# EAGLE design safeguard (EAGLE 8.4.0)
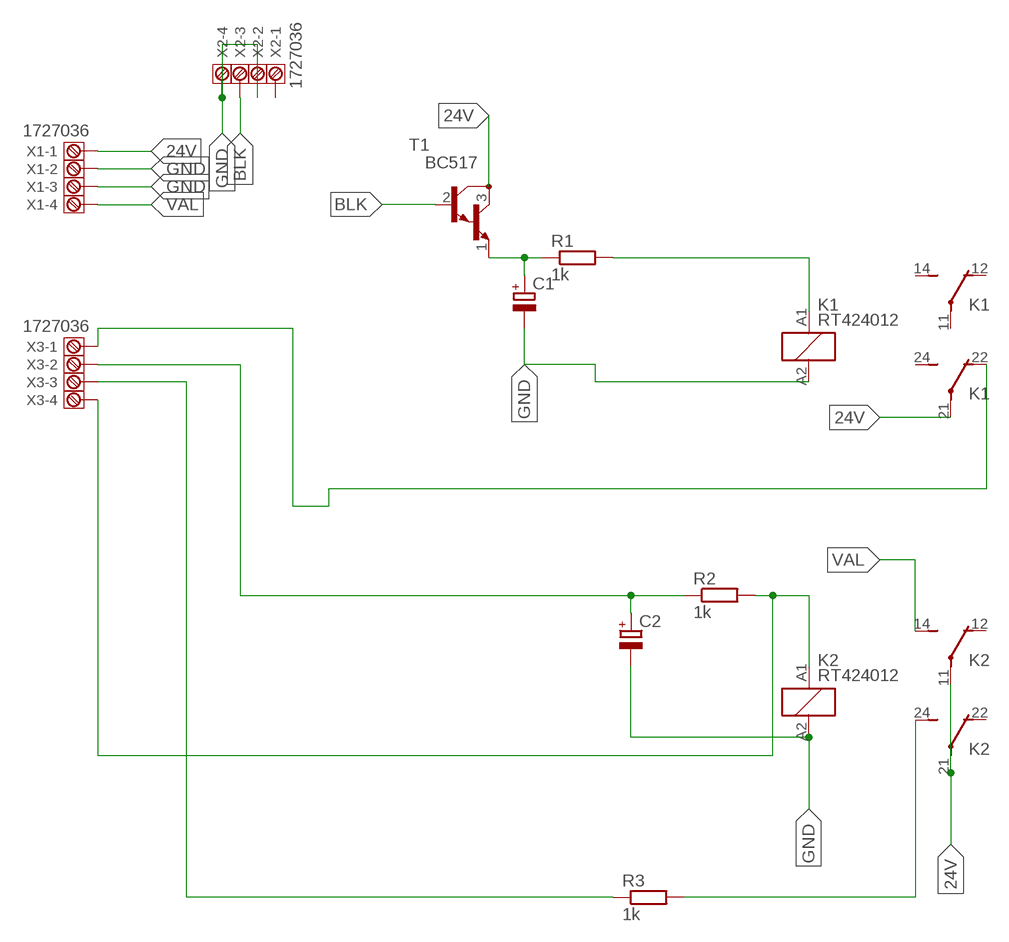
[diagram p0: schematic, sheet 1]

## Parts
C1  CPOL-EU153CLV-0405  [153CLV-0405]
C2  CPOL-EU153CLV-0405  [153CLV-0405]
K1  RT424012  [RT2C/O]
K2  RT424012  [RT2C/O]
R1  1k  R-EU_0204/7  [0204/7]
R2  1k  R-EU_0204/7  [0204/7]
R3  1k  R-EU_0204/7  [0204/7]
T1  BC517  [TO92]
X1  1727036  [1727036]
X2  1727036  [1727036]
X3  1727036  [1727036]

## Nets
24V: K1.21(3:P) K2.11(2:P) K2.21(3:P) T1.3(C) X1.1
BLK: T1.2(B) X2.3
GND: C1.- C2.- K1.A2 K2.A2 X1.2 X1.3 X2.2 X2.4
N$1: K1.22(3:O) X3.1
N$2: K2.A1 R2.2 X3.4
N$3: C1.+ R1.1 T1.1(E)
N$4: K1.A1 R1.2
N$6: C2.+ R2.1 X3.2
N$8: K2.24(3:S) R3.2
N$9: R3.1 X3.3
VAL: K2.14(2:S) X1.4
Unconnected: K1.11(2:P) K1.12(2:O) K1.14(2:S) K1.24(3:S) K2.12(2:O) K2.22(3:O) X2.1

## Library data of the parts
C1 C2 = resistor:CPOL-EU: POLARIZED CAPACITOR, European symbol
K1 K2 = relay:RT42?*: Power PCB Relay SCHRACK 2 pole 8 A, DC and AC-coil Source: http://www.schrack.com/.. 5842.pdf; MPN: RT424012; OC_FARNELL: 1629053; OC_NEWARK: 03P2426
R1-R3 = resistor:R-EU_: RESISTOR, European symbol
T1 = transistor-neu-to92:BC517: NPN BIPOLAR DARLINGTON TRANSISTOR
X1-X3 = con-phoenix-3.81:1727036: MKDS 1/4-3,81 Source: http://eshop.phoenixcontact.de; MF: FARNELL; MPN: 1727036; OC_FARNELL: 3704592; OC_NEWARK: 71C4114

## Board
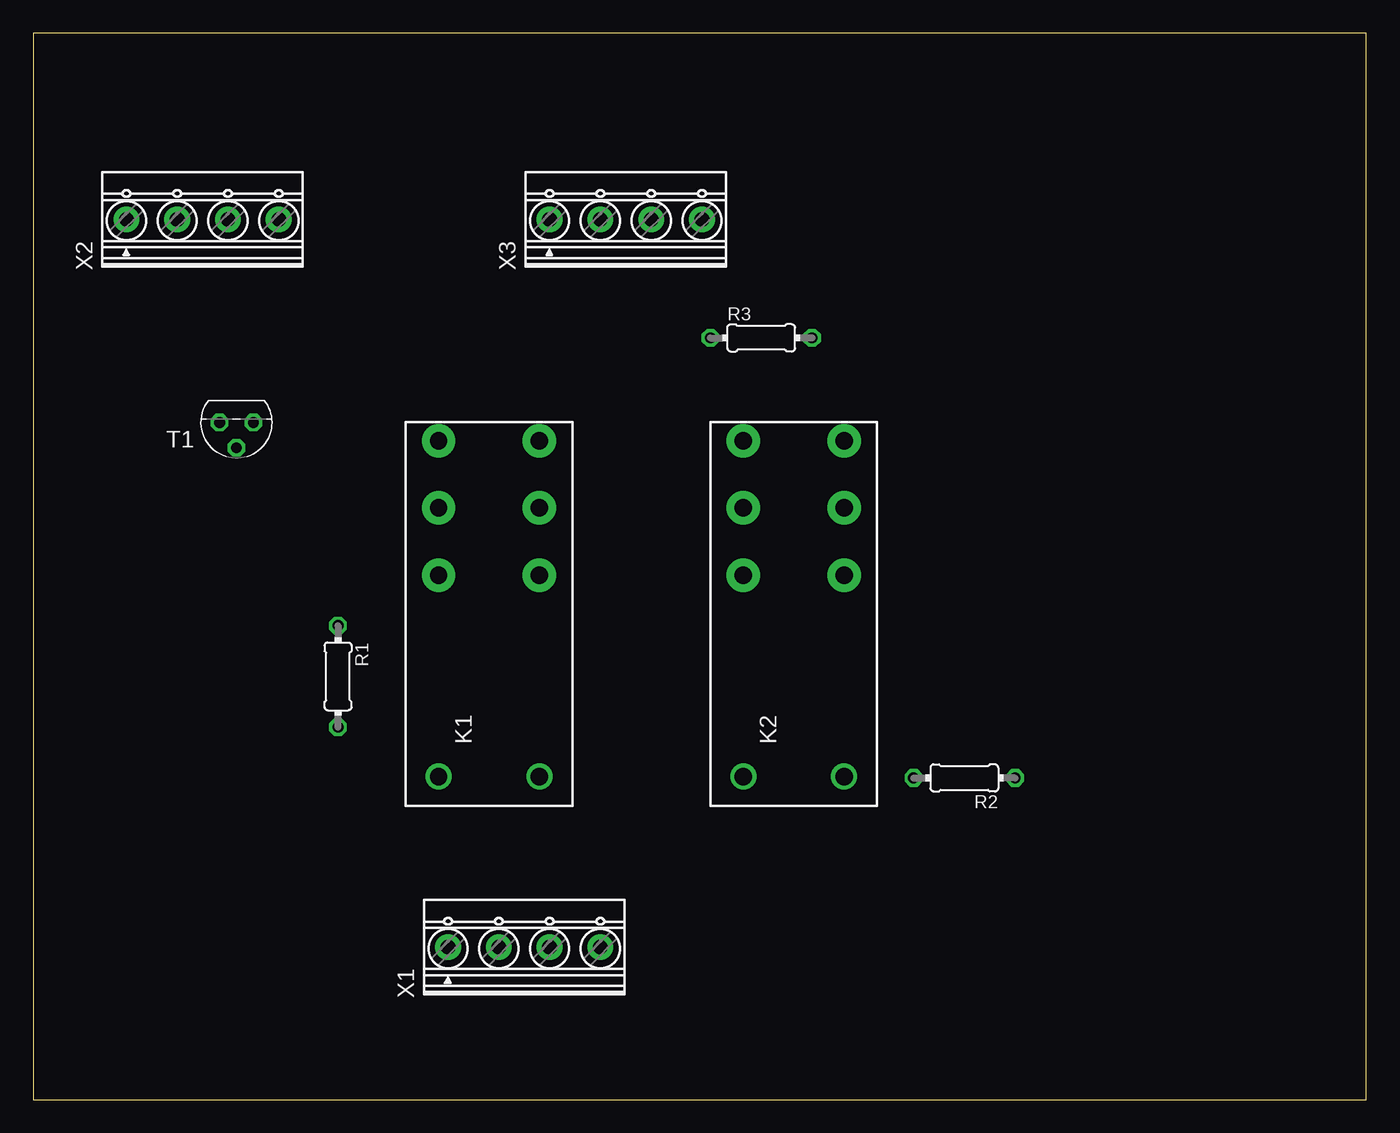
[diagram p1: board, top side]
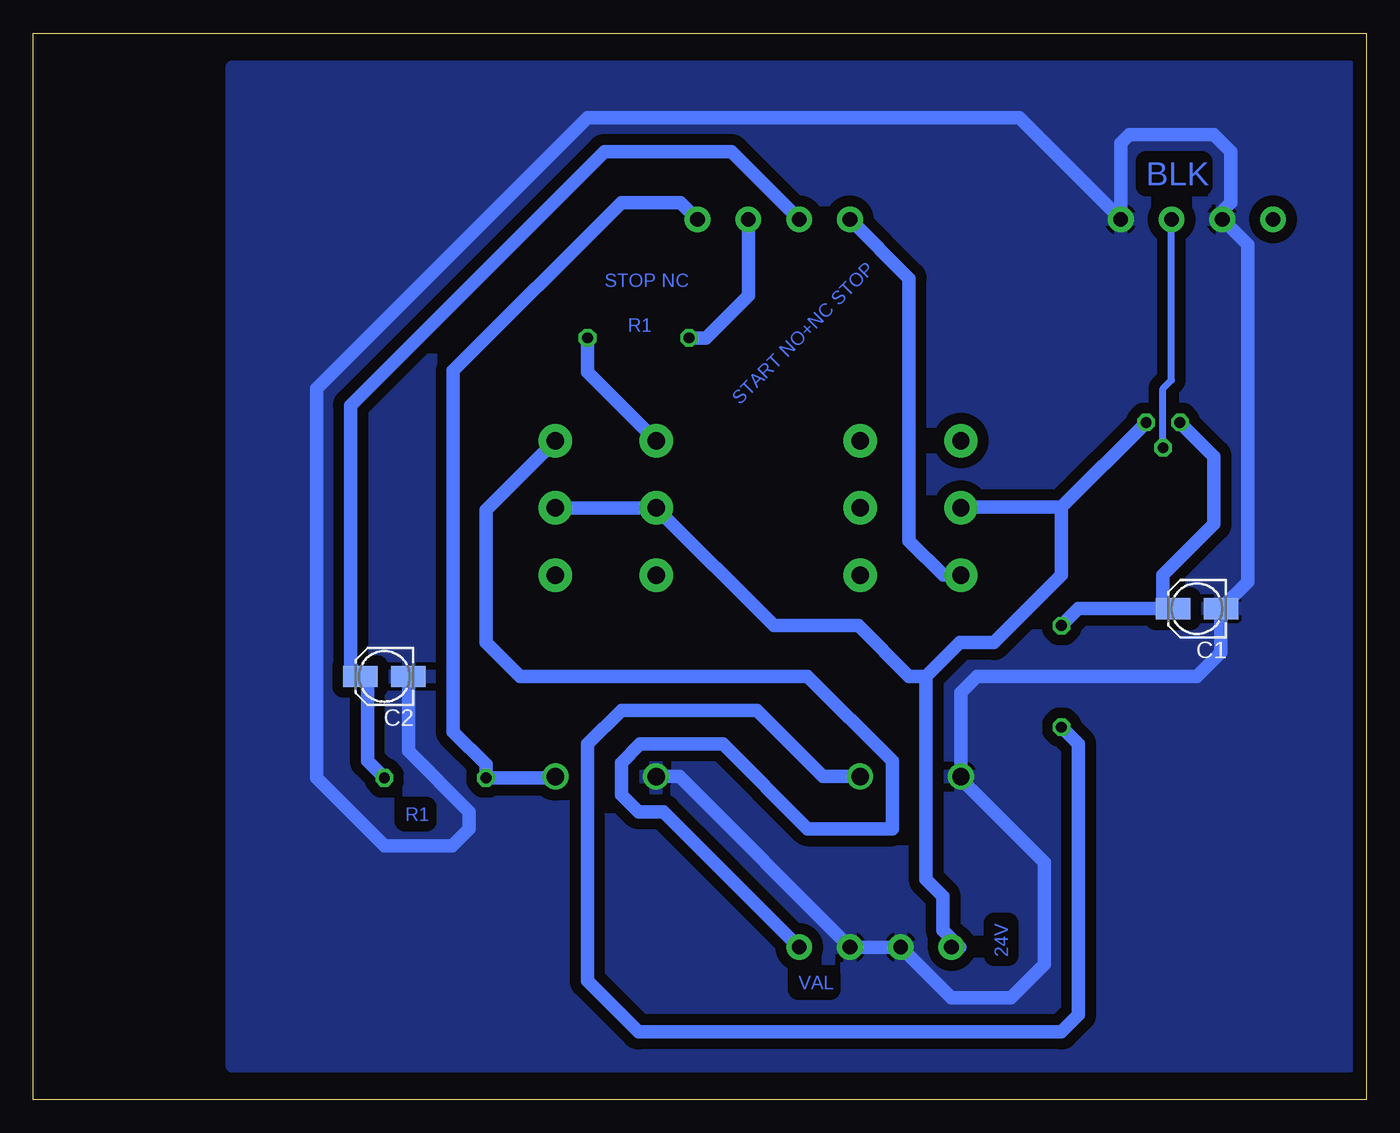
[diagram p2: board, bottom side, seen from below]

Size 100 x 80 mm. Coordinates in mm from the lower left corner, seen from the top.
Outline: 0,0 100,0 100,80 0,80 0,0
Copper layers (1*16): Top 0.035mm / dielectric 1.5mm / Bottom 0.035mm
Design rules "default": minimum track width 6mil, minimum drill 0.35mm, track to track 6mil, track to pad 6mil, pad to pad 6mil, via to via 6mil, smd to smd 6mil, copper to edge 40mil, drill to drill 6mil, minimum pad ring 10mil, minimum via ring 8mil, stop-mask expansion 4mil, vias tented up to drill 0mil, thermal gap 10mil

### Footprints (pad centres in the part's own frame; a part is rotated, then mirrored left to right if it is on the bottom)
153CLV-0405 = smd 2.6 x 1.6: + 1.8,0; - -1.8,0
RT2C/O = drill 1.3 pad 2.5: 11 7.56,-3.68; 12 2.52,-3.68; 14 12.6,-3.68; 21 7.56,3.88; 22 2.52,3.88; 24 12.6,3.88 | drill 1.3: A1 -12.6,-3.68; A2 -12.6,3.88
0204/7 = drill 0.813 octagon: 1 -3.81,0; 2 3.81,0
TO92 = drill 0.813 octagon: 1 1.27,0; 2 0,1.905; 3 -1.27,0
1727036 = drill 1.1 pad 1.93: 1 -5.715,0; 2 -1.905,0; 3 1.905,0; 4 5.715,0

### Placement (x,y rotation side)
C1  12.7,36.83 180 bottom
C2  73.66,31.75 180 bottom
K1  34.29,36.83 90 top
K2  57.15,36.83 90 top
R1  22.86,31.75 270 top
R2  69.85,24.13 180 top
R3  54.61,57.15 0 top
T1  15.24,50.8 180 top
X1  36.83,11.43 0 top
X2  12.7,66.04 0 top
X3  44.45,66.04 0 top

### Tracks (layer width: path | path; a pad name or v marks a point on that pad's centre or on a via)
24V
  Bottom 1.016: K2.11 K2.21 44.44,35.56 38.1,35.56 34.29,31.75 33.02,31.75 | T1.3 22.86,44.45 | 22.86,44.45 22.86,39.37 27.94,34.29 30.48,34.29 33.02,31.75 | X1.1 30.48,11.43 31.75,12.7 31.75,15.24 33.02,16.51 33.02,31.75 | 22.86,44.45 30.35,44.45 K1.21
BLK
  Bottom 0.508: T1.2 15.24,53.34 14.61,53.98 X2.3
GND
  Bottom 1.016: K2.A2 51.53,24.23 X1.3 X1.2 31.11,7.62 26.67,7.62 24.13,10.16 24.13,17.78 30.41,24.06 K1.A2 30.41,30.55 29.21,31.75 12.7,31.75 10.9,33.55 C1.- 8.89,38.84 8.89,64.14 X2.2 10.79,66.67 10.16,67.31 10.16,71.12 11.43,72.39 17.78,72.39 18.41,71.75 X2.4 26.04,73.66 58.42,73.66 78.74,53.34 78.74,24.13 73.66,19.05 68.58,19.05 67.31,20.32 67.31,21.59 71.86,26.14 C2.-
  pour Bottom (isolate 0.813): 1.27,77.47 85.09,77.47 85.09,2.54 1.27,2.54
N$1
  Bottom 1.016: K1.22 31.73,39.35 34.29,41.91 34.29,61.59 X3.1
N$2
  Bottom 1.016: K2.A1 60.93,24.13 R2.2 66.04,25.14 68.5,27.6 68.5,54.69 55.88,67.31 51.44,67.31 X3.4
N$3
  Bottom 1.016: R1.1 21.59,36.83 15.24,36.83 | 15.24,36.83 C1.+ | T1.1 11.43,48.26 11.43,43.18 15.24,39.37 15.24,36.83
N$4
  Bottom 1.016: R1.2 21.59,26.67 21.59,6.35 22.86,5.08 54.61,5.08 58.42,8.89 58.42,26.67 55.88,29.21 45.72,29.21 40.74,24.23 K1.A1
N$6
  Bottom 1.016: R2.1 74.93,25.4 74.93,31.22 C2.+ 76.2,32.49 76.2,52.07 57.15,71.12 47.62,71.12 X3.2
N$8
  Bottom 1.016: K2.24 58.42,54.58 R3.2
N$9
  Bottom 1.016: R3.1 49.53,57.15 46.35,60.33 X3.3
VAL
  Bottom 1.016: X1.4 52.7,21.59 54.61,21.59 55.88,22.86 55.88,25.27 54.48,26.67 48.26,26.67 41.91,20.32 35.56,20.32 35.56,25.4 41.91,31.75 63.5,31.75 66.04,34.29 66.04,44.22 K2.14

### Text on the board
Bottom: BLK | STOP NC | R1 | START NO+NC STOP | R1 | 24V | VAL